# EAGLE board schematic_March8 (EAGLE 9.3.0), part 1 of 2
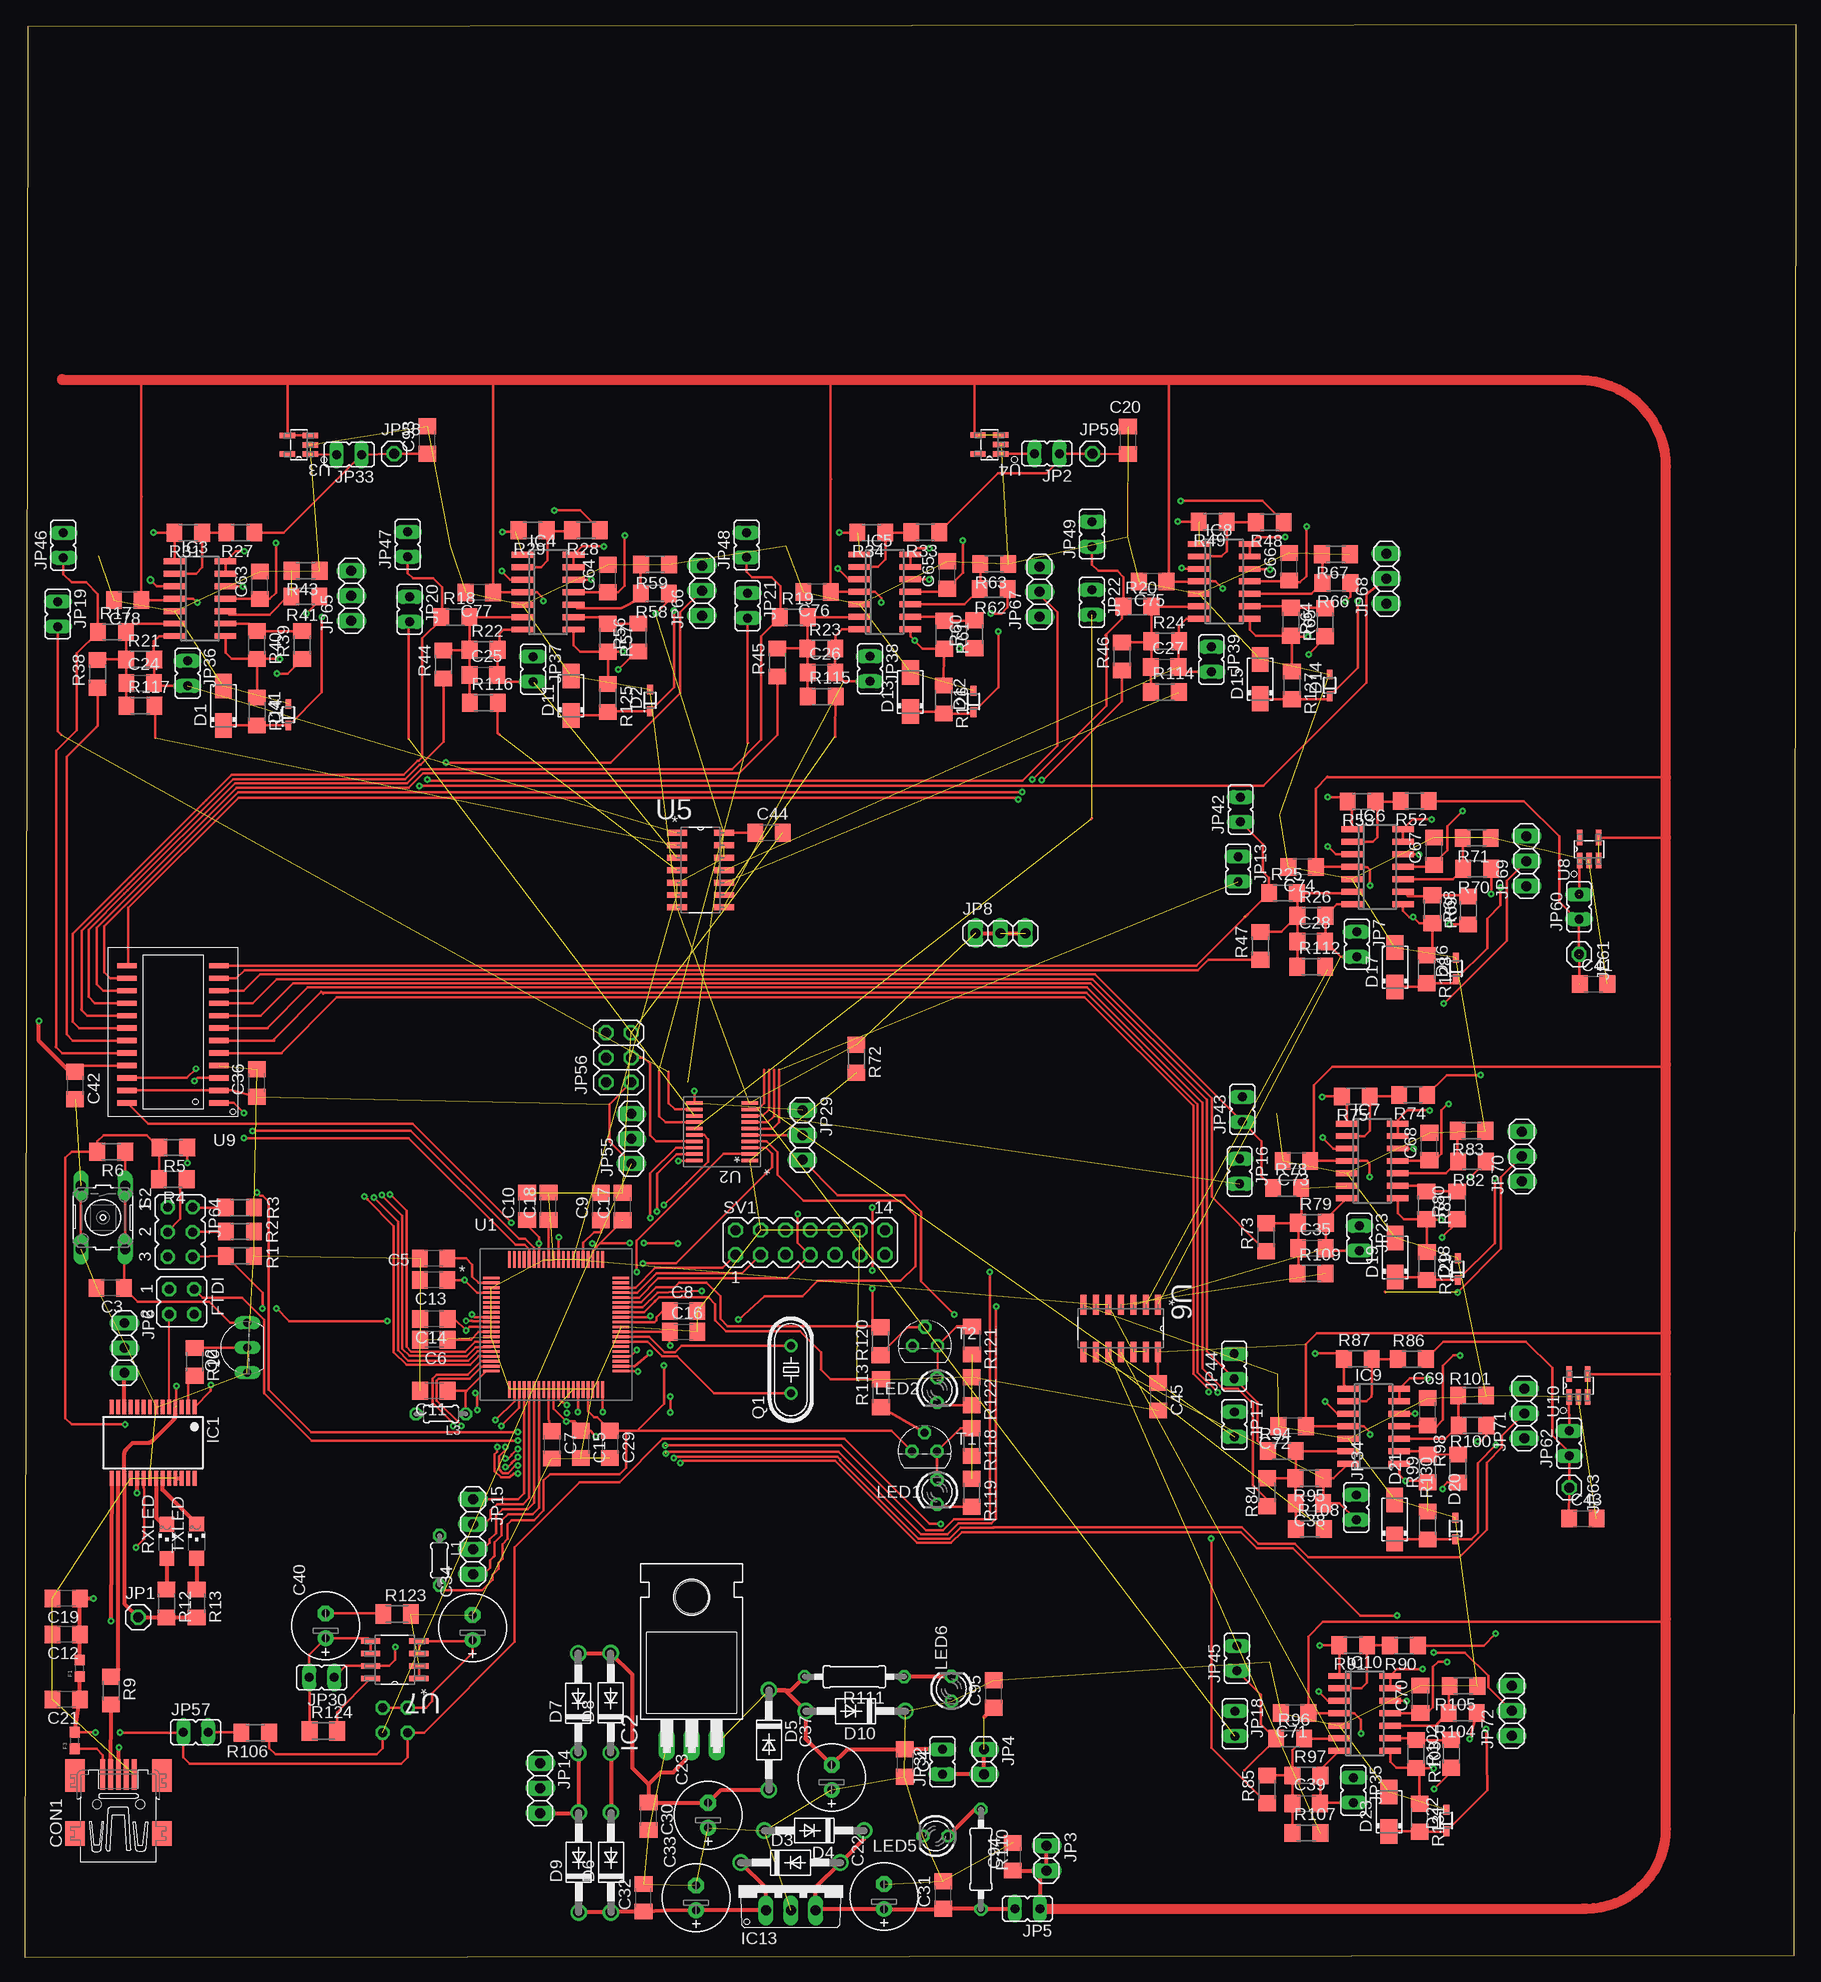
[diagram p2: board, top side]
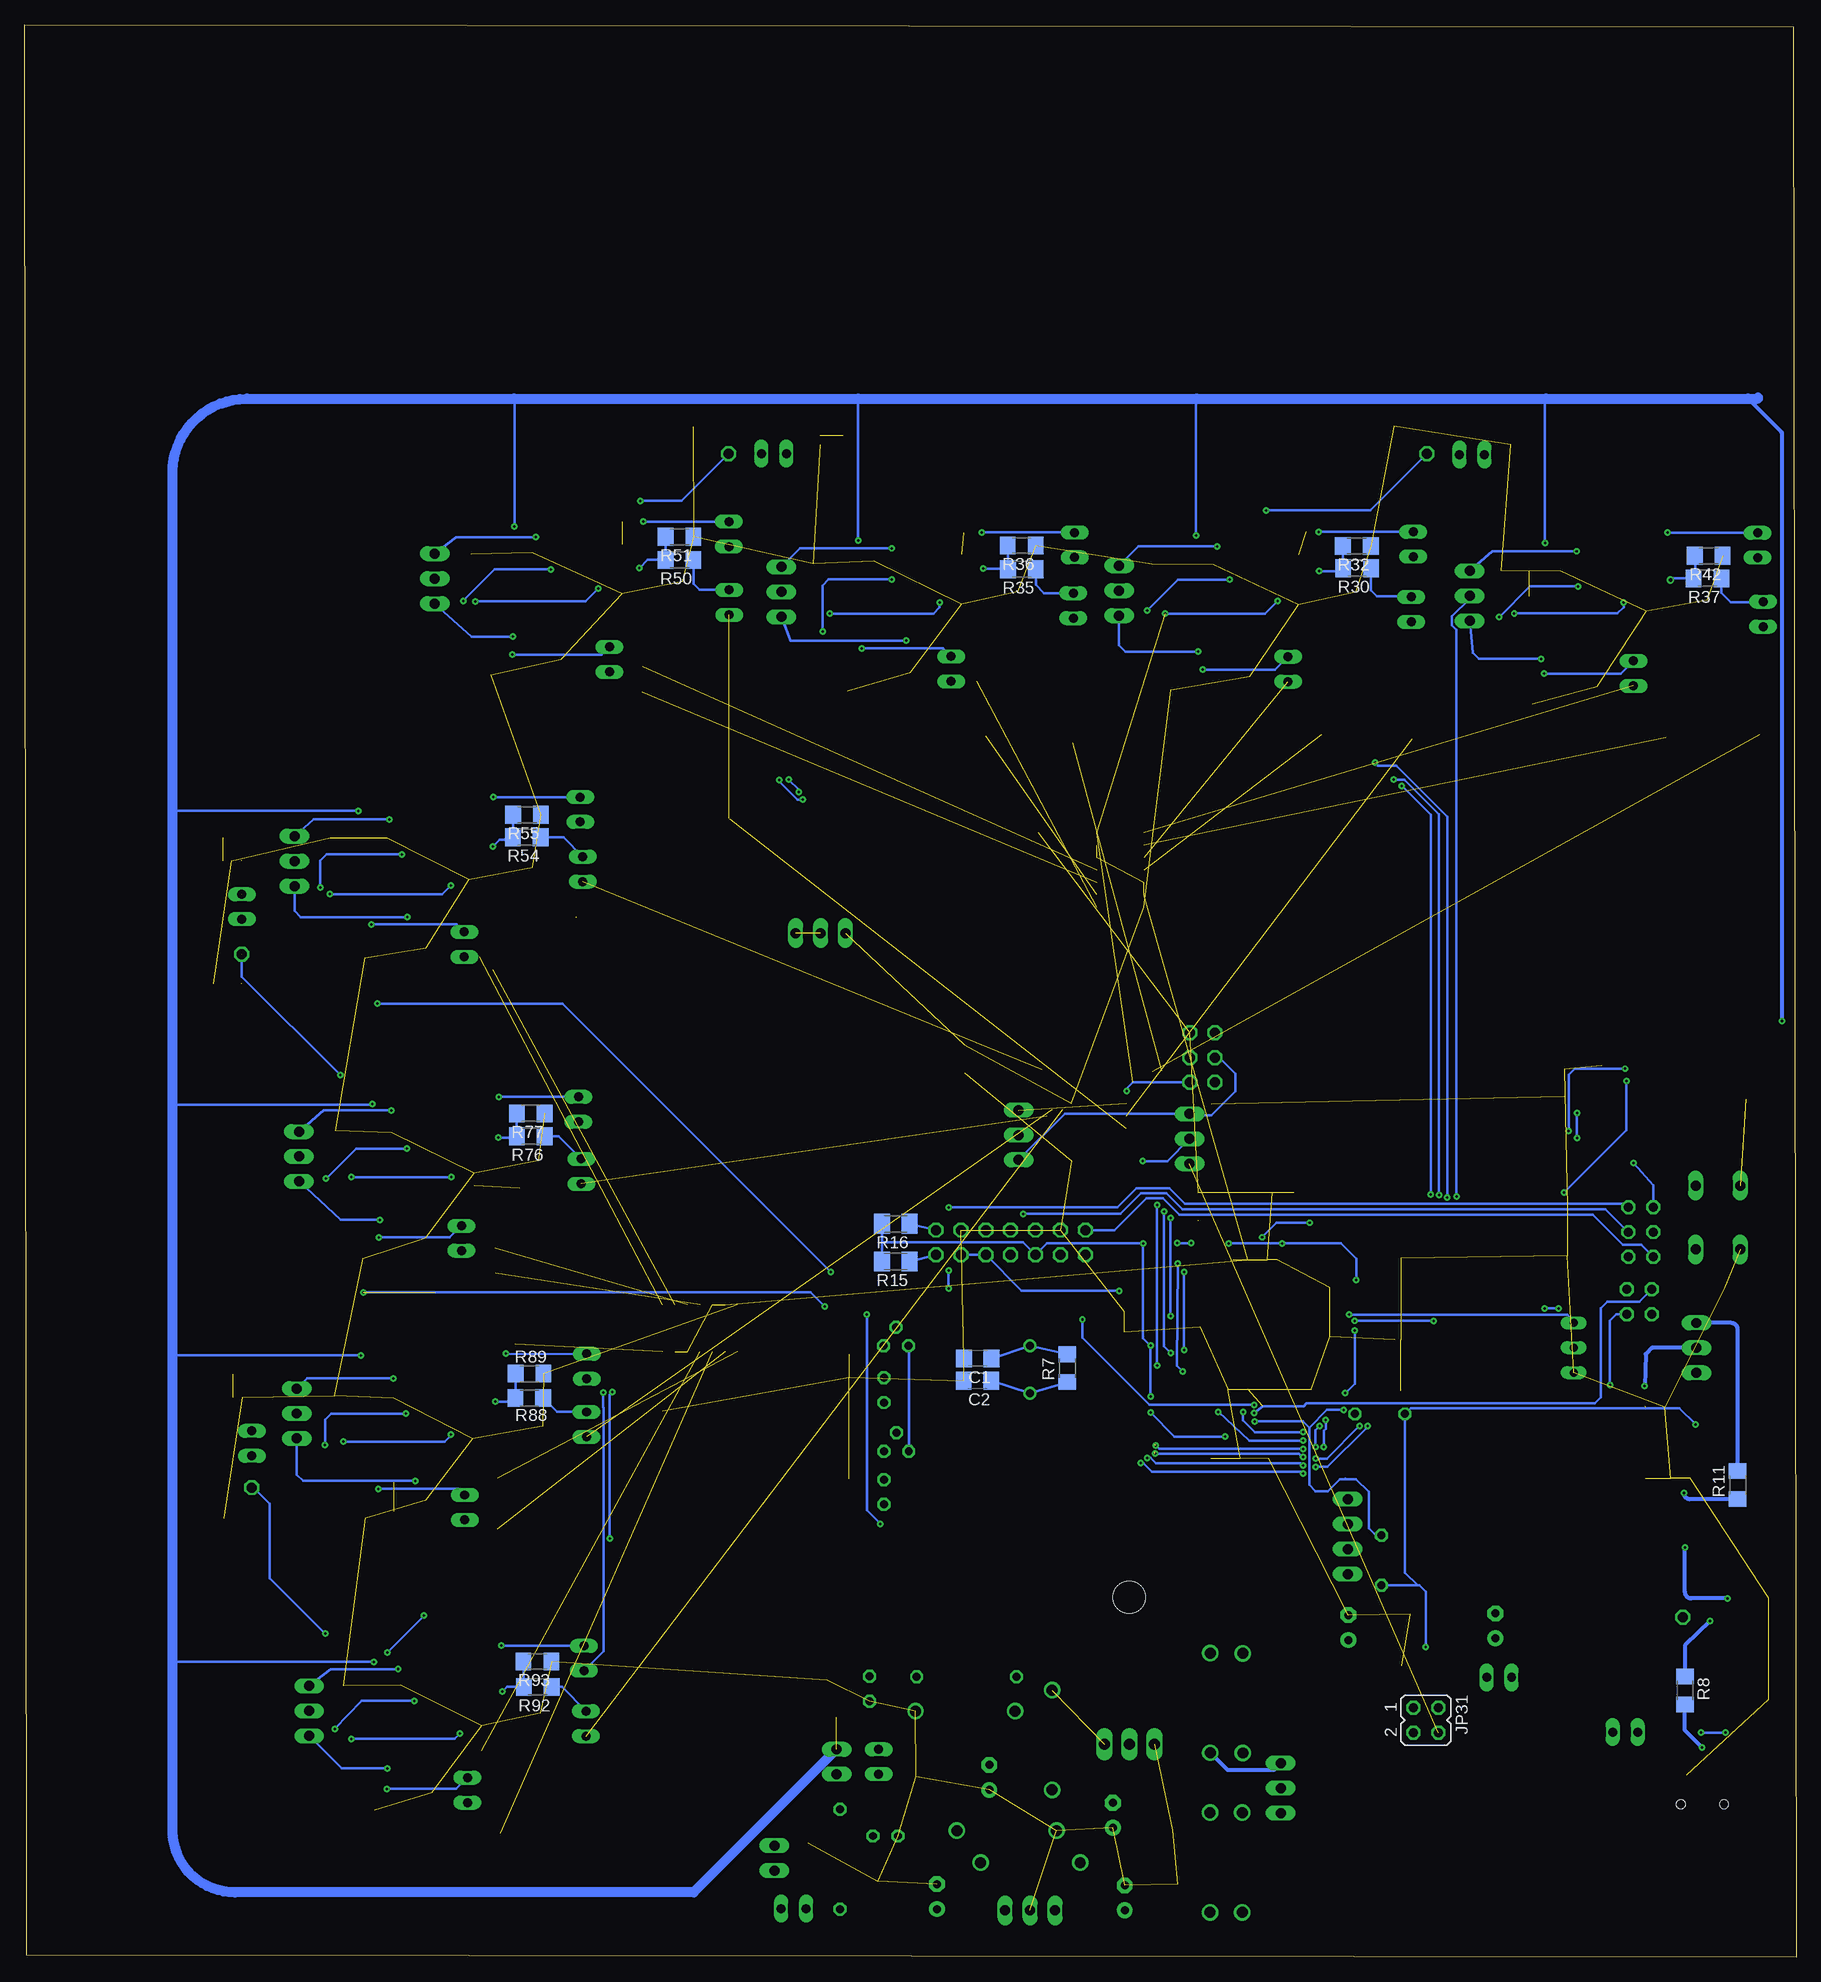
[diagram p3: board, bottom side, seen from below]

Size 180.6 x 196.95 mm. Coordinates in mm from the lower left corner, seen from the top.
Outline: 0,0 180.37,0.23 180.6,196.95 0.3,196.72 0,0
Copper layers (1*16): Top 0.035mm / dielectric 1.5mm / Bottom 0.035mm
Design rules "default *": minimum track width 8mil, minimum drill 10mil, track to track 7mil, track to pad 7mil, pad to pad 7mil, via to via 7mil, smd to smd 7mil, copper to edge 10mil, drill to drill 7mil, minimum pad ring 10mil, minimum via ring 8mil, stop-mask expansion 4mil, vias tented up to drill 0mil, thermal gap 10mil
Net classes: 1 power: width 0.254 mm

## Footprints (pad centres in the part's own frame; a part is rotated, then mirrored left to right if it is on the bottom)
C1206 = smd 1.6 x 1.8: 1 -1.4,0; 2 1.4,0
E2,5-7 = drill 0.813 pad 1.6: + -1.27,0 | drill 0.813 pad 1.6 octagon: - 1.27,0
32005-201 = smd 3.1 x 0.5: 1 3,1.6; 2 3,0.8; 3 3,0; 4 3,-0.8; 5 3,-1.6 | smd 2.5 x 2: M1 -3,-4.45; M2 -3,4.45 | smd 3.3 x 2: M3 2.9,4.45; M4 2.9,-4.45 | hole 0.9: 0,2.2; 0,-2.2
DO214AC = smd 2.5 x 1.7: A 2,0; C -2,0
SOD323F = smd 1 x 0.6: A 1.1,0; C -1.1,0
DO41-10 = drill 1.118: A 5.08,0; C -5.08,0
0603 = smd 1.1 x 1: 1 -0.85,0; 2 0.85,0
JP2Q = drill 0.914 octagon: 1 -1.27,-1.27; 2 1.27,-1.27; 3 -1.27,1.27; 4 1.27,1.27
SSOP28 = smd 0.4 x 1.5: 1 -4.225,-3.625; 2 -3.575,-3.625; 3 -2.925,-3.625; 4 -2.275,-3.625; 5 -1.625,-3.625; 6 -0.975,-3.625; 7 -0.325,-3.625; 8 0.325,-3.625; 9 0.975,-3.625; 10 1.625,-3.625; 11 2.275,-3.625; 12 2.925,-3.625; 13 3.575,-3.625; 14 4.225,-3.625; 15 4.225,3.625; 16 3.575,3.625; 17 2.925,3.625; 18 2.275,3.625; 19 1.625,3.625; 20 0.975,3.625; 21 0.325,3.625; 22 -0.325,3.625; 23 -0.975,3.625; 24 -1.625,3.625; 25 -2.275,3.625; 26 -2.925,3.625; 27 -3.575,3.625; 28 -4.225,3.625
TO220H = drill 1.118 long: 1 -2.54,-10.16; 2 0,-10.16; 3 2.54,-10.16 | hole 3.302: 0,4.826
SO14 = smd 0.6 x 2.2: 1 -3.81,-2.6; 2 -2.54,-2.6; 3 -1.27,-2.6; 4 0,-2.6; 5 1.27,-2.6; 6 2.54,-2.6; 7 3.81,-2.6; 8 3.81,2.6; 9 2.54,2.6; 10 1.27,2.6; 11 0,2.6; 12 -1.27,2.6; 13 -2.54,2.6; 14 -3.81,2.6
TO220V = drill 1.016 long: 1 -2.54,-2.54; 2 0,-2.54; 3 2.54,-2.54
1X01 = drill 1.016 octagon: 1 0,0
JP1 = drill 0.914 long: 1 0,-1.27; 2 0,1.27
1X02 = drill 1.016 long: 1 -1.27,0; 2 1.27,0
1X03 = drill 1.016 long: 1 -2.54,0; 2 0,0; 3 2.54,0
1X04 = drill 1.016 long: 1 -3.81,0; 2 -1.27,0; 3 1.27,0; 4 3.81,0
2X03 = drill 1.016 octagon: 1 -2.54,-1.27; 2 -2.54,1.27; 3 0,-1.27; 4 0,1.27; 5 2.54,-1.27; 6 2.54,1.27
JP3Q = drill 0.914 octagon: 1 -2.54,-1.27; 2 -2.54,1.27; 3 0,-1.27; 4 0,1.27; 5 2.54,-1.27; 6 2.54,1.27
0204/5 = drill 0.813 octagon: 1 -2.54,0; 2 2.54,0
LED3MM = drill 0.813 octagon: A -1.27,0; K 1.27,0
HC49/S = drill 0.813: 1 -2.413,0; 2 2.413,0
TO92-EBC = drill 0.813 long: B 0,-1.27; C -2.54,-1.27; E 2.54,-1.27
R1206 = smd 1.6 x 1.803: 1 -1.422,0; 2 1.422,0
M1206 = smd 1.6 x 2: 1 -1.4,0; 2 1.4,0
0207/10 = drill 0.813 octagon: 1 -5.08,0; 2 5.08,0
CHIPLED_1206 = smd 1.5 x 1.5: A 0,-1.75; C 0,1.75
B3F-10XX = drill 1.016 long: 1 -3.251,2.261; 2 3.251,2.261; 3 -3.251,-2.261; 4 3.251,-2.261
MA07-2 = drill 1.016 octagon: 1 -7.62,-1.27; 2 -7.62,1.27; 3 -5.08,-1.27; 4 -5.08,1.27; 5 -2.54,-1.27; 6 -2.54,1.27; 7 0,-1.27; 8 0,1.27; 9 2.54,-1.27; 10 2.54,1.27; 11 5.08,-1.27; 12 5.08,1.27; 13 7.62,-1.27; 14 7.62,1.27
TO92 = drill 0.813 octagon: 1 1.27,0; 2 0,1.905; 3 -1.27,0
PN80 = smd 1.676 x 0.279: 1 -6.617,4.75; 2 -6.617,4.25; 3 -6.617,3.75; 4 -6.617,3.25; 5 -6.617,2.75; 6 -6.617,2.25; 7 -6.617,1.75; 8 -6.617,1.25; 9 -6.617,0.75; 10 -6.617,0.25; 11 -6.617,-0.25; 12 -6.617,-0.75; 13 -6.617,-1.25; 14 -6.617,-1.75; 15 -6.617,-2.25; 16 -6.617,-2.75; 17 -6.617,-3.25; 18 -6.617,-3.75; 19 -6.617,-4.25; 20 -6.617,-4.75; 41 6.617,-4.75; 42 6.617,-4.25; 43 6.617,-3.75; 44 6.617,-3.25; 45 6.617,-2.75; 46 6.617,-2.25; 47 6.617,-1.75; 48 6.617,-1.25; 49 6.617,-0.75; 50 6.617,-0.25; 51 6.617,0.25; 52 6.617,0.75; 53 6.617,1.25; 54 6.617,1.75; 55 6.617,2.25; 56 6.617,2.75; 57 6.617,3.25; 58 6.617,3.75; 59 6.617,4.25; 60 6.617,4.75 | smd 0.279 x 1.676: 21 -4.75,-6.617; 22 -4.25,-6.617; 23 -3.75,-6.617; 24 -3.25,-6.617; 25 -2.75,-6.617; 26 -2.25,-6.617; 27 -1.75,-6.617; 28 -1.25,-6.617; 29 -0.75,-6.617; 30 -0.25,-6.617; 31 0.25,-6.617; 32 0.75,-6.617; 33 1.25,-6.617; 34 1.75,-6.617; 35 2.25,-6.617; 36 2.75,-6.617; 37 3.25,-6.617; 38 3.75,-6.617; 39 4.25,-6.617; 40 4.75,-6.617; 61 4.75,6.617; 62 4.25,6.617; 63 3.75,6.617; 64 3.25,6.617; 65 2.75,6.617; 66 2.25,6.617; 67 1.75,6.617; 68 1.25,6.617; 69 0.75,6.617; 70 0.25,6.617; 71 -0.25,6.617; 72 -0.75,6.617; 73 -1.25,6.617; 74 -1.75,6.617; 75 -2.25,6.617; 76 -2.75,6.617; 77 -3.25,6.617; 78 -3.75,6.617; 79 -4.25,6.617; 80 -4.75,6.617
PW20 = smd 1.676 x 0.356: 1 -2.819,2.925; 2 -2.819,2.275; 3 -2.819,1.625; 4 -2.819,0.975; 5 -2.819,0.325; 6 -2.819,-0.325; 7 -2.819,-0.975; 8 -2.819,-1.625; 9 -2.819,-2.275; 10 -2.819,-2.925; 11 2.819,-2.925; 12 2.819,-2.275; 13 2.819,-1.625; 14 2.819,-0.975; 15 2.819,-0.325; 16 2.819,0.325; 17 2.819,0.975; 18 2.819,1.625; 19 2.819,2.275; 20 2.819,2.925
DDC0005A_N = smd 1.575 x 0.559: 1 -1.168,0.95; 2 -1.168,0; 3 -1.168,-0.95; 4 1.168,-0.95; 5 1.168,0.95
SOIC127P600X175-14N = smd 2.057 x 0.61: 1 -4.801,7.62; 2 -4.801,6.35; 3 -4.801,5.08; 4 -4.801,3.81; 5 -4.801,2.54; 6 -4.801,1.27; 7 -4.801,0; 8 0,0; 9 0,1.27; 10 0,2.54; 11 0,3.81; 12 0,5.08; 13 0,6.35; 14 0,7.62
SOIC127P600X175-8N = smd 1.981 x 0.559: 1 -2.464,1.905; 2 -2.464,0.635; 3 -2.464,-0.635; 4 -2.464,-1.905; 5 2.464,-1.905; 6 2.464,-0.635; 7 2.464,0.635; 8 2.464,1.905
21-0042B_24 = smd 1.981 x 0.533: 1 -4.686,6.985; 2 -4.686,5.715; 3 -4.686,4.445; 4 -4.686,3.175; 5 -4.686,1.905; 6 -4.686,0.635; 7 -4.686,-0.635; 8 -4.686,-1.905; 9 -4.686,-3.175; 10 -4.686,-4.445; 11 -4.686,-5.715; 12 -4.686,-6.985; 13 4.686,-6.985; 14 4.686,-5.715; 15 4.686,-4.445; 16 4.686,-3.175; 17 4.686,-1.905; 18 4.686,-0.635; 19 4.686,0.635; 20 4.686,1.905; 21 4.686,3.175; 22 4.686,4.445; 23 4.686,5.715; 24 4.686,6.985

## Placement (x,y rotation side)
C1  36p  [C1206]  83.44,61.01 180 bottom
C2  36p  [C1206]  83.46,58.75 180 bottom
C3  0.1u  [C1206]  8.74,68.2 180 top
C4  0.1uF  [C1206]  89.71,19.81 270 top
C5  2.2u  [C1206]  41.71,71.22 180 top
C6  2.2u  [C1206]  41.73,62.94 180 top
C7  2.2u  [C1206]  53.75,52.22 270 top
C8  2.2u  [C1206]  67.16,65.86 0 top
C9  2.2u  [C1206]  58.75,76.5 90 top
C10  2.2u  [C1206]  51.23,76.53 90 top
C11  2.2u  [C1206]  41.73,57.73 180 top
C12  100nF  [C1206]  4.24,32.89 180 top
C13  2.2u  [C1206]  41.71,69.01 180 top
C14  2.2u  [C1206]  41.73,65.05 180 top
C15  2.2u  [C1206]  56.69,52.27 270 top
C16  2.2u  [C1206]  67.16,63.75 0 top
C17  2.2u  [C1206]  60.96,76.5 90 top
C18  2.2u  [C1206]  53.42,76.53 90 top
C19  4.7uF  [C1206]  4.24,36.58 180 top
C20  2.2u  [C1206]  112.47,154.58 90 top
C21  10nF  [C1206]  4.24,26.29 180 top
C22  10uF  [E2,5-7]  87.6,6.2 90 top
C23  1000uF  [E2,5-7]  69.67,14.48 90 top
C24  [C1206]  11.79,129.87 0 top
C25  [C1206]  46.76,130.68 0 top
C26  [C1206]  81.23,130.91 0 top
C27  [C1206]  116.2,131.5 0 top
C28  [C1206]  131.14,103.5 0 top
C29  0.1u  [C1206]  59.66,52.27 270 top
C30  0.1uF  [C1206]  63.6,14.38 270 top
C31  0.1uF  [C1206]  93.62,6.35 90 top
C32  0.1uF  [C1206]  63.09,6.07 90 top
C33  1000uF  [E2,5-7]  68.45,6.07 90 top
C34  0.1uF  [E2,5-7]  45.67,33.6 90 top
C35  [C1206]  131.22,72.26 0 top
C36  2.2u  [C1206]  23.67,89.1 90 top
C37  10uF  [E2,5-7]  82.27,18.34 90 top
C38  [C1206]  130.96,46.28 0 top
C39  [C1206]  130.63,15.7 0 top
C40  10uF  [E2,5-7]  30.68,33.78 90 top
C41  2.2u  [C1206]  159.92,99.19 0 top
C42  2.2u  [C1206]  5.16,88.85 270 top
C43  2.2u  [C1206]  158.83,44.73 0 top
C44  2.2u  [C1206]  75.87,114.6 0 top
C45  2.2u  [C1206]  115.54,57.12 270 top
C63  2.2u  [C1206]  24,139.83 90 top
C64  2.2u  [C1206]  59.44,140.51 90 top
C65  2.2u  [C1206]  94.03,140.87 90 top
C66  2.2u  [C1206]  128.88,141.71 90 top
C67  2.2u  [C1206]  143.66,112.7 90 top
C68  2.2u  [C1206]  143.18,82.63 90 top
C69  2.2u  [C1206]  143,55.6 90 top
C70  2.2u  [C1206]  142.27,26.31 90 top
C71  2.2u  [C1206]  129.46,24.89 180 top
C72  2.2u  [C1206]  129.21,54.13 180 top
C73  2.2u  [C1206]  129.64,81.15 180 top
C74  2.2u  [C1206]  130.23,111.1 180 top
C75  2.2u  [C1206]  114.99,140.18 180 top
C76  2.2u  [C1206]  80.77,139.14 180 top
C77  2.2u  [C1206]  46.36,139.09 180 top
C78  2.2u  [C1206]  10.52,138.3 180 top
C93  2.2u  [C1206]  41.05,154.61 90 top
C94  2.2u  [C1206]  100.74,10.26 90 top
C95  2.2u  [C1206]  98.78,26.85 90 top
CON1  UBC05V128-B0C04D  [32005-201]  9.58,15.62 90 top
D1  1SMA5913BT3G  [DO214AC]  20.27,127.53 90 top
D2  1N914BWS  [SOD323F]  63.75,128.09 90 top
D3  1N4004  [DO41-10]  78.08,9.65 0 top
D4  1N4004  [DO41-10]  80.49,12.93 180 top
D5  1N4004  [DO41-10]  75.87,22.15 270 top
D6  1N4004  [DO41-10]  59.77,9.68 90 top
D7  1N4004  [DO41-10]  56.44,25.91 90 top
D8  1N4004  [DO41-10]  59.74,25.93 90 top
D9  1N4004  [DO41-10]  56.49,9.68 90 top
D10  1N4004  [DO41-10]  84.71,25.1 180 top
D11  1SMA5913BT3G  [DO214AC]  55.7,128.55 90 top
D12  1N914BWS  [SOD323F]  96.72,127.97 90 top
D13  1SMA5913BT3G  [DO214AC]  90.3,128.93 90 top
D14  1N914BWS  [SOD323F]  133.02,129.62 90 top
D15  1SMA5913BT3G  [DO214AC]  125.93,130.25 90 top
D16  1N914BWS  [SOD323F]  145.9,100.76 90 top
D17  1SMA5913BT3G  [DO214AC]  139.67,100.89 90 top
D18  1N914BWS  [SOD323F]  146.1,70.13 90 top
D19  1SMA5913BT3G  [DO214AC]  139.7,71.32 90 top
D20  1N914BWS  [SOD323F]  145.85,43.71 90 top
D21  1SMA5913BT3G  [DO214AC]  139.65,44.63 90 top
D22  1N914BWS  [SOD323F]  144.91,13.94 90 top
D23  1SMA5913BT3G  [DO214AC]  139.06,14.83 90 top
D41  1N914BWS  [SOD323F]  26.9,126.62 90 top
F1  500mA  [0603]  5.64,29.46 90 top
F3  500mA  [0603]  5.13,22.1 90 top
FTDI  [JP2Q]  16.03,66.8 270 top
IC1  FT232RL  [SSOP28]  13.11,52.45 180 top
IC2  [TO220H]  68,31.88 0 top
IC3  TL084D  [SO14]  17.88,138.46 270 top
IC4  TL084D  [SO14]  53.37,139.12 270 top
IC5  TL084D  [SO14]  87.68,139.14 270 top
IC6  TL084D  [SO14]  137.9,111.12 270 top
IC7  TL084D  [SO14]  137.36,81.15 270 top
IC8  TL084D  [SO14]  122.28,140.21 270 top
IC9  TL084D  [SO14]  137.52,54.13 270 top
IC10  TL084D  [SO14]  136.6,24.87 270 top
IC13  7805TV  [TO220V]  78.11,7.34 0 top
JP1  [1X01]  11.58,34.65 0 top
JP2  [JP1]  104.22,153.24 90 top
JP3  [1X02]  104.17,10.11 270 top
JP4  [1X02]  97.82,19.94 270 top
JP5  [JP1]  102.21,4.98 90 top
JP6  [1X03]  10.19,62.1 270 top
JP7  [JP1]  135.79,103.23 180 top
JP8  [1X03]  99.47,104.37 0 top
JP13  [JP1]  123.7,110.9 180 top
JP14  [1X03]  52.55,17.25 270 top
JP15  [1X04]  45.72,42.88 270 top
JP16  [JP1]  123.85,80.09 180 top
JP17  [JP1]  123.32,54.31 180 top
JP18  [JP1]  123.37,23.83 180 top
JP19  [JP1]  3.4,136.88 180 top
JP20  [JP1]  39.27,137.36 180 top
JP21  [JP1]  73.71,137.74 180 top
JP22  [JP1]  108.79,138.07 180 top
JP23  [JP1]  136.07,73.28 180 top
JP29  [1X03]  79.27,83.79 270 top
JP30  [JP1]  30.3,28.52 90 top
JP31  [JP2Q]  37.77,24.18 270 bottom
JP32  [JP1]  93.55,19.94 0 top
JP33  [JP1]  33.07,153.14 90 top
JP34  pls  [JP1]  135.74,45.85 180 top
JP35  [JP1]  135.46,17.04 180 top
JP36  [JP1]  16.61,130.84 180 top
JP37  [JP1]  51.82,131.27 180 top
JP38  [JP1]  86.16,131.29 180 top
JP39  [JP1]  120.98,132.26 180 top
JP42  [JP1]  123.95,116.97 0 top
JP43  [JP1]  124.13,86.41 0 top
JP44  Int_inp  [JP1]  123.29,60.22 0 top
JP45  [JP1]  123.57,30.48 0 top
JP46  [JP1]  3.96,143.89 0 top
JP47  [JP1]  39.07,143.99 0 top
JP48  [JP1]  73.58,143.92 0 top
JP49  [JP1]  108.81,145.03 0 top
JP55  [1X03]  61.85,83.41 90 top
JP56  [2X03]  60.55,91.69 90 top
JP57  [JP1]  17.45,22.96 270 top
JP58  [1X01]  37.67,153.21 0 top
JP59  [1X01]  108.84,153.21 0 top
JP60  [JP1]  158.45,107.06 0 top
JP61  [1X01]  158.45,102.21 270 top
JP62  [JP1]  157.43,52.37 0 top
JP63  [1X01]  157.43,47.88 270 top
JP64  [JP3Q]  15.85,73.91 270 top
JP65  [1X03]  33.3,138.73 90 top
JP66  [1X03]  69.04,139.27 90 top
JP67  [1X03]  103.45,139.14 90 top
JP68  [1X03]  138.79,140.49 90 top
JP69  [1X03]  153.09,111.71 90 top
JP70  [1X03]  152.63,81.61 90 top
JP71  [1X03]  152.86,55.42 90 top
JP72  [1X03]  151.59,25.12 90 top
L1  BKP1005HS221-T  [0204/5]  42.29,40.46 270 top
L3  BKP1005HS221-T  [0204/5]  42.44,55.37 180 top
LED1  [LED3MM]  93.01,47.42 270 top
LED2  [LED3MM]  93.01,57.81 270 top
LED5  [LED3MM]  92.86,12.37 180 top
LED6  [LED3MM]  94.46,27.36 90 top
Q1  [HC49/S]  78.11,59.89 90 top
Q2  BC557  [TO92-EBC]  21.44,62.13 90 top
R1  2.2k  [R1206]  21.95,71.48 180 top
R2  2.2k  [R1206]  21.95,73.96 180 top
R3  2.2k  [R1206]  21.95,76.4 180 top
R4  820  [R1206]  15.11,79.3 180 top
R5  820  [R1206]  15.16,82.52 180 top
R6  2.2k  [R1206]  8.84,82.09 180 top
R7  1M  [R1206]  74.32,60.05 90 bottom
R8  33  [R1206]  11.35,27.2 270 bottom
R9  33  [R1206]  8.81,27.18 270 top
R10  2.2k  [R1206]  17.35,60.68 270 top
R11  10k  [R1206]  5.99,48.13 90 bottom
R12  270  [R1206]  14.48,36.07 270 top
R13  270  [R1206]  17.55,36.07 270 top
R14  [R1206]  23.7,126.95 270 top
R15  4.7k  [M1206]  91.8,70.89 180 bottom
R16  4.7k  [M1206]  91.8,74.75 180 bottom
R17  [R1206]  8.92,135.05 0 top
R18  [R1206]  43.92,136.58 0 top
R19  [R1206]  78.41,136.55 0 top
R20  [R1206]  113.44,137.64 0 top
R21  [R1206]  11.79,132.26 0 top
R22  [R1206]  46.79,133.25 0 top
R23  [R1206]  81.2,133.38 0 top
R24  [R1206]  116.26,134.11 0 top
R25  [R1206]  128.27,108.46 0 top
R26  [R1206]  131.17,106.15 0 top
R27  [R1206]  22,145.19 180 top
R28  [R1206]  57.23,145.41 180 top
R29  [R1206]  51.79,145.41 180 top
R30  [R1206]  44.78,141.55 180 bottom
R31  [R1206]  16.69,145.16 180 top
R32  [R1206]  44.81,143.81 180 bottom
R33  [R1206]  91.8,145.21 180 top
R34  [R1206]  86.31,145.19 180 top
R35  [R1206]  78.94,141.45 180 bottom
R36  [R1206]  78.97,143.87 180 bottom
R37  [R1206]  9.07,140.51 180 bottom
R38  [R1206]  7.44,130.78 90 top
R39  [R1206]  28.3,133.73 90 top
R40  [R1206]  23.67,133.73 270 top
R41  [R1206]  28.63,138.68 180 top
R42  [R1206]  8.94,142.82 180 bottom
R43  [R1206]  28.65,141.3 180 top
R44  [R1206]  42.7,131.75 90 top
R45  [R1206]  76.73,131.95 90 top
R46  [R1206]  111.86,132.56 90 top
R47  [R1206]  125.96,103.07 90 top
R48  [R1206]  126.92,146.23 180 top
R49  [R1206]  121.11,146.28 180 top
R50  [R1206]  113.84,142.39 180 bottom
R51  [R1206]  113.84,144.75 180 bottom
R52  [R1206]  141.68,117.83 180 top
R53  [R1206]  136.27,117.78 180 top
R54  [R1206]  129.41,114.15 180 bottom
R55  [R1206]  129.39,116.43 180 bottom
R56  [R1206]  62.56,134.49 90 top
R57  [R1206]  59.46,134.47 270 top
R58  [R1206]  64.24,138.99 180 top
R59  [R1206]  64.26,141.94 180 top
R60  [R1206]  96.82,134.82 90 top
R61  [R1206]  93.73,134.77 270 top
R62  [R1206]  98.78,139.42 180 top
R63  [R1206]  98.83,141.99 180 top
R64  [R1206]  132.56,136.04 90 top
R65  [R1206]  129.08,136.09 270 top
R66  [R1206]  133.71,140.06 180 top
R67  [R1206]  133.65,142.98 180 top
R68  [R1206]  147.14,106.68 90 top
R69  [R1206]  143.48,106.81 270 top
R70  [R1206]  148.06,110.92 180 top
R71  [R1206]  148.01,114.07 180 top
R72  0  [R1206]  84.79,91.57 270 top
R73  [R1206]  126.54,73.38 90 top
R74  [R1206]  141.53,87.88 180 top
R75  [R1206]  135.69,87.73 180 top
R76  [R1206]  129.01,83.67 180 bottom
R77  [R1206]  129.01,86 180 bottom
R78  [R1206]  128.7,78.38 0 top
R79  [R1206]  131.22,74.85 0 top
R80  [R1206]  146.02,76.63 90 top
R81  [R1206]  142.88,76.63 270 top
R82  [R1206]  147.52,81.1 180 top
R83  [R1206]  147.47,84.23 180 top
R84  [R1206]  126.64,47.4 90 top
R85  [R1206]  126.64,17.12 90 top
R86  [R1206]  141.4,60.96 180 top
R87  [R1206]  135.89,60.99 180 top
R88  [R1206]  129.16,57 180 bottom
R89  [R1206]  129.13,59.49 180 bottom
R90  [R1206]  140.59,31.78 180 top
R91  [R1206]  135.41,31.8 180 top
R92  [R1206]  128.3,27.56 180 bottom
R93  [R1206]  128.32,30.15 180 bottom
R94  [R1206]  128.14,51.59 0 top
R95  [R1206]  130.96,48.82 0 top
R96  [R1206]  129.01,22.3 0 top
R97  [R1206]  130.66,18.54 0 top
R98  [R1206]  146.1,49.81 90 top
R99  [R1206]  143,49.83 270 top
R100  [R1206]  147.57,54.2 180 top
R101  [R1206]  147.55,57.25 180 top
R102  [R1206]  145.41,20.75 90 top
R103  [R1206]  141.83,20.73 270 top
R104  [R1206]  146.58,24.92 180 top
R105  [R1206]  146.66,27.66 180 top
R106  0  [R1206]  23.52,22.89 180 top
R107  [R1206]  130.66,12.67 0 top
R108  [R1206]  131.01,43.66 0 top
R109  [R1206]  131.17,69.7 0 top
R110  1K  [0207/10]  97.49,10.01 270 top
R111  1K  [0207/10]  84.58,28.6 180 top
R112  [R1206]  131.14,100.94 0 top
R113  470  [R1206]  87.3,57.48 90 top
R114  [R1206]  116.23,128.93 0 top
R115  [R1206]  81.25,128.47 0 top
R116  [R1206]  46.81,127.84 0 top
R117  [R1206]  11.81,127.53 0 top
R118  10k  [R1206]  96.55,52.5 270 top
R119  470  [R1206]  96.55,47.35 270 top
R120  470  [R1206]  87.25,62.79 90 top
R121  10k  [R1206]  96.57,62.87 270 top
R122  470  [R1206]  96.55,57.68 270 top
R123  1  [M1206]  37.97,34.98 0 top
R124  1  [M1206]  30.45,23.06 0 top
R125  [R1206]  59.46,128.32 270 top
R126  [R1206]  93.68,128.17 270 top
R127  [R1206]  129.18,129.62 270 top
R128  [R1206]  142.9,100.69 270 top
R129  [R1206]  142.93,70.46 270 top
R130  [R1206]  143,44.02 270 top
R131  [R1206]  142.19,14.22 270 top
RXLED  [CHIPLED_1206]  14.5,42.39 0 top
S2  [B3F-10XX]  8,75.39 270 top
SV1  JTAG  [MA07-2]  80.09,72.85 0 top
T1  BC547  [TO92]  91.74,51.56 0 top
T2  BC547  [TO92]  91.77,62.31 0 top
TXLED  [CHIPLED_1206]  17.55,42.42 0 top
U1  TMS320F28069_PN_80  [PN80]  54.18,64.49 0 top
U2  TLV5610_PW_20  [PW20]  71.09,84.12 180 top
U3  REF2030AIDDCR  [DDC0005A_N]  27.97,154.13 180 top
U4  REF2030AIDDCR  [DDC0005A_N]  98.35,154.15 180 top
U5  TS12A44514DR  [SOIC127P600X175-14N]  71.3,106.98 0 top
U6  TS12A44514DR  [SOIC127P600X175-14N]  107.92,61.7 270 top
U7  TPS7333QD  [SOIC127P600X175-8N]  37.74,30.33 180 top
U8  REF2030AIDDCR  [DDC0005A_N]  159.46,112.93 90 top
U9  MAX395CWG+  [21-0042B_24]  15.14,94.06 180 top
U10  REF2030AIDDCR  [DDC0005A_N]  158.37,58.27 90 top